# Altium schematic sheet v1.0.SchDoc
size 147 x 38 mm; PageSetup: Record=PageOptions|CenterHorizontal=True|CenterVertical=True|PrintScale=0.71|XCorrection=1.00|YCorrection=1.00|PrintKind=1|BorderSize=5000000|LeftOffset=0|BottomOffset=0|Orientation=2|PaperLength=1000|PaperWidth=1000|Scale=100|PaperSource=15|PrintQuality=4000|MediaType=1|DitherType=10|PrintScaleMode=1|PaperKind=A4|PaperIndex=9
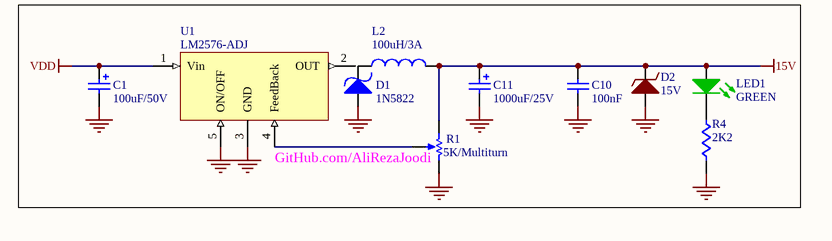
[diagram p0: v1.0.SchDoc]

## Parts
C1  100uF/50V  [CAPPR3.05-3.81x6.35]
C10  value 100nF  [CAPNTO2.54-3.05x1.78A]  (hidden comment: Cap)
C11  1000uF/25V  [CAPPR5-10x12.5]
D1  Device: 1N5822  [DIODE-0.7]  (hidden comment: Diode_SCHOTTKY)
D2  15V  [D_THD_AXIAL0.3_DO-35]
L2  value 100uH/3A  [INDUCTOR-2V]  (hidden comment: Inductor)
LED1  GREEN  [LED_THD_5MM_GREEN]
R1  5K/Multiturn  [VR4_]
R4  value 2K2  [AXIAL-0.4]  (hidden comment: Res1)
U1  LM2576-ADJ  [TO220-5H]

## Nets
15V: C10.2 C11.1 D2.2 L2.2 LED1.1(A) R1.2(BOT)
GND: C1.2 C10.1 C11.2 D1.1(A) D2.1 R1.1(TOP) R4.2 U1.3(GND) U1.5(ON/OFF)
VDD: C1.1 U1.1(Vin)
NetD1_2: D1.2(K) L2.1
NetLED1_2: LED1.2(K) R4.1
NetR1_3: R1.3(TAP) U1.4(FeedBack)

Not connected (* = marked no-connect by the designer): U1 2(OUT)

## Notes on the sheet
- (near R1) GitHub.com/AliRezaJoodi

## Library data of the parts
C1 C11 = Cap Pol1: Polarized Capacitor (Radial); Manufacturer: Generic Components; Class I: Passive; Published: 8-Jun-2000; Revision: July-2002: Re-released for DXP Platform.; Publisher: Altium Limited; Class II: Capacitor
C10 = Cap: Capacitor; Manufacturer: Generic Components; Class I: Passive; Published: 8-Jun-2000; Revision: July-2002: Re-released for DXP Platform.; Publisher: Altium Limited; Class II: Capacitor
D1 = Diode_SCHOTTKY: Diode; Manufacturer: Generic Components; Class I: Discrete; Class II: Diode - Switching; Published: 8-Jun-2000; Revision: July-2002: Re-released for DXP Platform.; Publisher: Altium Limited; Supplier 1: Farnell
D2 = Diode_Zener: Diode, Zener; Revision: July-2002: Re-released for DXP Platform.
L2 = Inductor: Manufacturer: Generic Components; Class I: Passive; Published: 8-Jun-2000; Revision: July-2002: Re-released for DXP Platform.; Publisher: Altium Limited; Class II: Inductor; Supplier 1: Newark
LED1 = LED_GREEN: LED, Green; Manufacturer: Generic Components; Class I: Optoelectronic; Published: 8-Jun-2000; Revision: July-2002: Re-released for DXP Platform.; Publisher: Altium Limited; Class II: LED
R1 = RPot1: Potentiometer; Manufacturer: Generic Components; Class I: Passive; Set Position: 0.5; Published: 8-Jun-2000; Revision: July-2002: Re-released for DXP Platform.; Publisher: Altium Limited; Class II: Potentiometer
R4 = Res1: Resistor; Manufacturer: Generic Components; Class I: Passive; Published: 8-Jun-2000; Revision: July-2002: Re-released for DXP Platform.; Publisher: Altium Limited; Class II: Resistor
U1 = VoltageRegulator_Switching_StepDown: Step-Down Voltage  Regulator